# Altium schematic sheet Water_Level_Indicator_PCB.SchDoc
size A; SheetNumber: 1; SheetTotal: 1
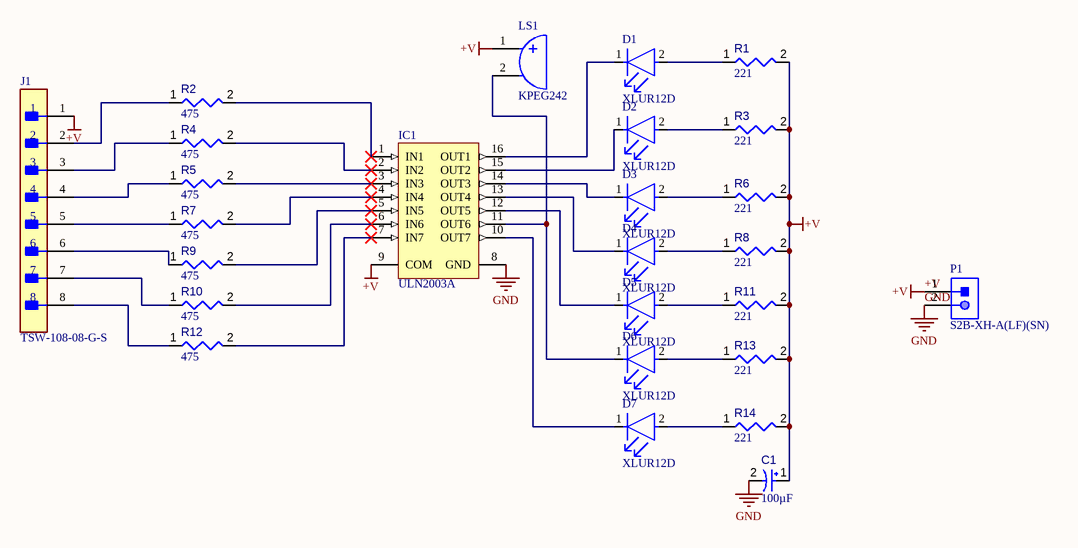
[diagram p0: Water_Level_Indicator_PCB.SchDoc]

## Parts
C1  value 100µF  [CAPPR65-350-1150X800X1250]  (hidden comment: ECA1HM101)
D1  XLUR12D  [FP-XLUR12D-MFG]
D2  XLUR12D  [FP-XLUR12D-MFG]
D3  XLUR12D  [FP-XLUR12D-MFG]
D4  XLUR12D  [FP-XLUR12D-MFG]
D5  XLUR12D  [FP-XLUR12D-MFG]
D6  XLUR12D  [FP-XLUR12D-MFG]
D7  XLUR12D  [FP-XLUR12D-MFG]
IC1  ULN2003A  [STM-DIP-16L]
J1  TSW-108-08-G-S  [FP-TSW-108-08-G-S-MFG]
LS1  KPEG242  [KINGS-KPEG242-2]
P1  S2B-XH-A(LF)(SN)  [JST-S2B-XH-A(LF)(SN)_V]
R1  value 221  [RESA60-630X240]  (hidden comment: MFR-25FBF52-221R)
R2  value 475  [RESA60-630X240]  (hidden comment: MFR-25FBF52-475R)
R3  value 221  [RESA60-630X240]  (hidden comment: MFR-25FBF52-221R)
R4  value 475  [RESA60-630X240]  (hidden comment: MFR-25FBF52-475R)
R5  value 475  [RESA60-630X240]  (hidden comment: MFR-25FBF52-475R)
R6  value 221  [RESA60-630X240]  (hidden comment: MFR-25FBF52-221R)
R7  value 475  [RESA60-630X240]  (hidden comment: MFR-25FBF52-475R)
R8  value 221  [RESA60-630X240]  (hidden comment: MFR-25FBF52-221R)
R9  value 475  [RESA60-630X240]  (hidden comment: MFR-25FBF52-475R)
R10  value 475  [RESA60-630X240]  (hidden comment: MFR-25FBF52-475R)
R11  value 221  [RESA60-630X240]  (hidden comment: MFR-25FBF52-221R)
R12  value 475  [RESA60-630X240]  (hidden comment: MFR-25FBF52-475R)
R13  value 221  [RESA60-630X240]  (hidden comment: MFR-25FBF52-221R)
R14  value 221  [RESA60-630X240]  (hidden comment: MFR-25FBF52-221R)

## Nets
+V: C1.1 IC1.9(COM) J1.1 LS1.1 P1.1 R1.2 R3.2 R6.2 R8.2 R11.2 R13.2 R14.2
GND: C1.2 IC1.8(GND) P1.2
NetD1_1: D1.1(C) IC1.16(OUT1)
NetD1_2: D1.2(A) R1.1
NetD2_1: D2.1(C) IC1.15(OUT2)
NetD2_2: D2.2(A) R3.1
NetD3_1: D3.1(C) IC1.14(OUT3)
NetD3_2: D3.2(A) R6.1
NetD4_1: D4.1(C) IC1.13(OUT4)
NetD4_2: D4.2(A) R8.1
NetD5_1: D5.1(C) IC1.12(OUT5)
NetD5_2: D5.2(A) R11.1
NetD6_1: D6.1(C) IC1.11(OUT6) LS1.2
NetD6_2: D6.2(A) R13.1
NetD7_1: D7.1(C) IC1.10(OUT7)
NetD7_2: D7.2(A) R14.1
NetIC1_1: IC1.1(IN1) R2.2
NetIC1_2: IC1.2(IN2) R4.2
NetIC1_3: IC1.3(IN3) R5.2
NetIC1_4: IC1.4(IN4) R7.2
NetIC1_5: IC1.5(IN5) R9.2
NetIC1_6: IC1.6(IN6) R10.2
NetIC1_7: IC1.7(IN7) R12.2
NetJ1_2: J1.2 R2.1
NetJ1_3: J1.3 R4.1
NetJ1_4: J1.4 R5.1
NetJ1_5: J1.5 R7.1
NetJ1_6: J1.6 R9.1
NetJ1_7: J1.7 R10.1
NetJ1_8: J1.8 R12.1

## Library data of the parts
C1 = CMP-001-00026-7: Aluminum Electrolytic Capacitor, 100 uF, +/- 20%, 50 V, -40 to 85 degC, 2-Pin THD, RoHS, Bulk; Manufacturer: Panasonic; Voltage Rating: 50V; Ripple Current: 250mA; Datasheet URL: https://industrial.panasonic.com/cdbs/www-data/pdf/RDF0000/ABA0000C1218.pdf; Lead Pitch: 3.5mm; Mounting Technology: TH; Package Description: 2-Pin Radial Lead, Dia 8 mm, Height 12.5 mm; Diameter: 8mm; Ripple Current (AC): 250mA; Manufacturer URL: http://www.panasonic.com/; Capacitor Type: Electrolytic; Max Operating Temperature: 85°C; Pins: 2; Min Operating Temperature: -40°C; Tolerance: 20%; Case/Package: Radial; Packaging: Bulk; Package Quantity: 200; Package Reference: CAPPR65-350-1150X800X1250; RoHS Compliant: True; Datasheet Version: Rev. 05, 10/2016
D1-D7 = CMP-02085-08376351-1: 627nm Red LED; 5x8.6mm, Through-Hole Mount with Red Diffused Round Lamp; Test Current: 10mA; Viewing Angle: 30°; Dominant Wavelength: 617nm; Luminous Intensity: 39mcd; Forward Voltage: 1.9V; Wavelength: 627nm; Case/Package: Radial; Lens Color: Red; Mount: Through Hole; Height: 8.6mm; Color: Red; Lifecycle Status: Production; Lens Transparency: Diffused; RoHS: Compliant
IC1 = CMP-2000-07351-1: Seven Darlington Array, 50 V, 0.5 A, -40 to 85 degC, 16-Pin DIP, RoHS, Tube; Manufacturer: STMicroelectronics; Transistor Polarity: NPN; VOUT: 50V; No. of Pins: 16Pins; SVHC: NoSVHC(17-Dec-2015); DC Current Gain hFE: 1000hFE; Output Current: 0.5A; DC Collector Current: 500mA; Transistor Case Style: DIP; Package Reference: DIP-16L; Automotive Qualification Standard: -; Mounting Technology: ThroughHole; Power Dissipation Pd: -; Collector Emitter Voltage V(br)ceo: 50V; Datasheet URL: http://www2.st.com/content/ccc/resource/technical/document/datasheet/f3/6e/c8/64/4d/b3/4e/38/CD00001244.pdf/files/CD00001244.pdf/jcr:content/translations/en.CD00001244.pdf; Manufacturer URL: http://www.st.com/; PartNumber: ULN2003A; MSL: MSL2-1year; Product Range: -; Package Description: 16-Pin DIP, Body 19.7 x 7.1 mm, Pitch 2.54 mm; Operating Temperature Max: 85°C; Datasheet Version: Rev. 8, 06/2012
J1 = CMP-02766-000001-1: CONN HEADER VERT 8POS 2.54MM; Manufacturer: Samtec; Number Of Contacts: 8; Conn Orientation: Straight; Conn Gender: Male; Device Class L1: Connectors; ComponentLink2Description: Datasheet; Digikey Description: CONN HEADER VERT 8POS 2.54MM; ComponentLink2URL: http://suddendocs.samtec.com/catalog_english/tsw_th.pdf; Temperature: -55°C to +125°C; RoHS: TRUE; Mouser Description: TSW - Samtec 2.54mm Pin Header 13.46mm Overall Pin Length 5.08mm Tail; Automotive: No; Temperature Range High: +125°C; Package: TSW-108-08-G-S; Device Class L3: unset; Manufacturer Part Number: TSW-108-08-G-S; Pitch: 2.54mm; Number Of Rows: 1; Lead Free: Yes; Height: 8.71mm; Contact Material: Gold,Nickel; Footprint Url: http://suddendocs.samtec.com/prints/tsw-xxx-xx-x-x-xx-xxx-footprint.pdf; Temperature Range Low: -55°C; Octopart: https://octopart.com/tsw-108-08-g-s-samtec-272653; Category: Conn; Device Class L2: Headers and Wire Housings
LS1 = CMP-2000-06518-1: Piezo Indicator, 4100 Hz, 3 to 16 V, -20 to 70 degC, 2-Pin THD, RoHS; PartNumber: KPE-242; Manufacturer: KingstateElectronicsCorp.; Frequency Range: 3600to4600Hz; Maximum Supply Current: 7mA; Typical Operating Supply Voltage: 12Vdc; Product Height: 7.6mm; Current - Max: 7A; Tone Mode: Continuous; Product Diameter: 13.7mm; Minimum Sound Pressure: 70dBA; Maximum Resonant Frequency: 4600Hz; Type: Indicator; Datasheet URL: https://datasheet.ciiva.com/11776/0900766b8068f3a2-11776713.pdf; Mounting: ThroughHole; Technology: Piezo; Operating Temperature: -20to70°C; Category: AudioIndicatorsandAlerts; Termination Method: Pin; Manufacturer URL: http://www.kingstate.com.tw/index.php/en/; Package Description: 2-Pin Through Hole Device, Body Dia 13.7 mm, Pitch 7.62 mm; Datasheet Version: 01/2006; Package Reference: KPEG242; Mounting Technology: ThroughHole
P1 = CMP-002-00032-2: Male Header, Pitch 2.5 mm, 1 x 2 Position, Height 6.1 mm, Tail Length 3.4 mm, -25 to 85 degC, RoHS, Bulk; Manufacturer: JST; Case/Package: S2B-XH-A(LF)(SN); Package Description: XH Series Disconnectable Crimp Style Connector, Pitch 2.5 mm, 1 x 2 Position, Height 6.1 mm, Tail Length 3.4 mm; Manufacturer URL: http://www.jst.com/home2.html; Datasheet URL: http://www.jst-mfg.com/product/pdf/eng/eXH.pdf; Connector Type: Header; Package Reference: S2B-XH-A(LF)(SN); Mounting Technology: TH; Max Operating Temperature: 85°C; Min Operating Temperature: -25°C; Datasheet Version: May-16; Gender: Male; RoHS Compliant: Unknown
R1 R3 R6 R8 R11 R13 R14 = CMP-009-00051-4: Axial Resistor, 221 Ohm, +/- 1%, 250 mW, -55 to 155 degC, 2-Pin THD, RoHS, Bulk; Manufacturer: Yageo; Power: 250mW; Voltage Rating: 250V; Package Quantity: 200; Manufacturer URL: http://www.yageo.com/; Case/Package: Axial; Package Reference: MFR-25; RoHS Compliant: True; Mounting Technology: TH; Datasheet URL: http://www.yageo.com/documents/recent/Yageo%20LR_MFR_2013.pdf; Packaging: Bulk; Package Description: 2-Pin Axial Lead, Dia 2.4 mm, Body Length 6.3 mm; Max Operating Temperature: 155°C; Tolerance: 1%; Datasheet Version: Apr-13; Min Operating Temperature: -55°C
R2 R4 R5 R7 R9 R10 R12 = CMP-009-00056-4: Axial Resistor, 475 Ohm, +/- 1%, 0.25 W, -55 to 155 degC, 2-Pin THD, RoHS, Bulk; Manufacturer: Yageo; Voltage Rating: 250V; Power: 250mW; Case/Package: Axial; Datasheet URL: http://www.yageo.com/documents/recent/Yageo%20LR_MFR_2013.pdf; Tolerance: 1%; RoHS Compliant: True; Mounting Technology: TH; Packaging: Bulk; Package Description: 2-Pin Axial Lead, Dia 2.4 mm, Body Length 6.3 mm; Max Operating Temperature: 155°C; Package Reference: MFR-25; Datasheet Version: Apr-13; Min Operating Temperature: -55°C; Package Quantity: 200; Manufacturer URL: http://www.yageo.com/